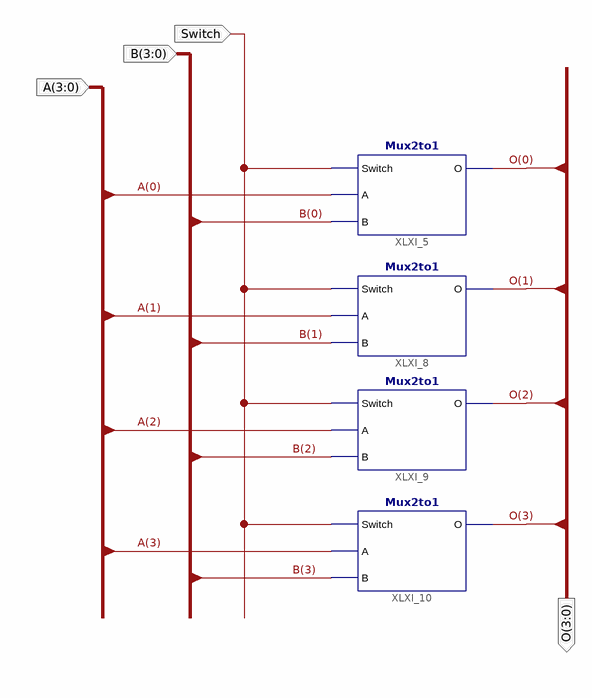
[diagram p0: schematic sheet 1]
// Xilinx ISE schematic Mux2to1_4Bit_Bus.sch (spartan3e) as structural Verilog: 4 symbols, 4 ports
module Mux2to1_4Bit_Bus (
  input  [3:0] B,
  input  Switch,
  input  [3:0] A,
  output [3:0] O
);

  Mux2to1 XLXI_10 (.Switch(Switch), .A(A[3]), .B(B[3]), .O(O[3]));
  Mux2to1 XLXI_9 (.Switch(Switch), .A(A[2]), .B(B[2]), .O(O[2]));
  Mux2to1 XLXI_8 (.Switch(Switch), .A(A[1]), .B(B[1]), .O(O[1]));
  Mux2to1 XLXI_5 (.Switch(Switch), .A(A[0]), .B(B[0]), .O(O[0]));
endmodule
